# Altium project PCB_Project.PrjPcb
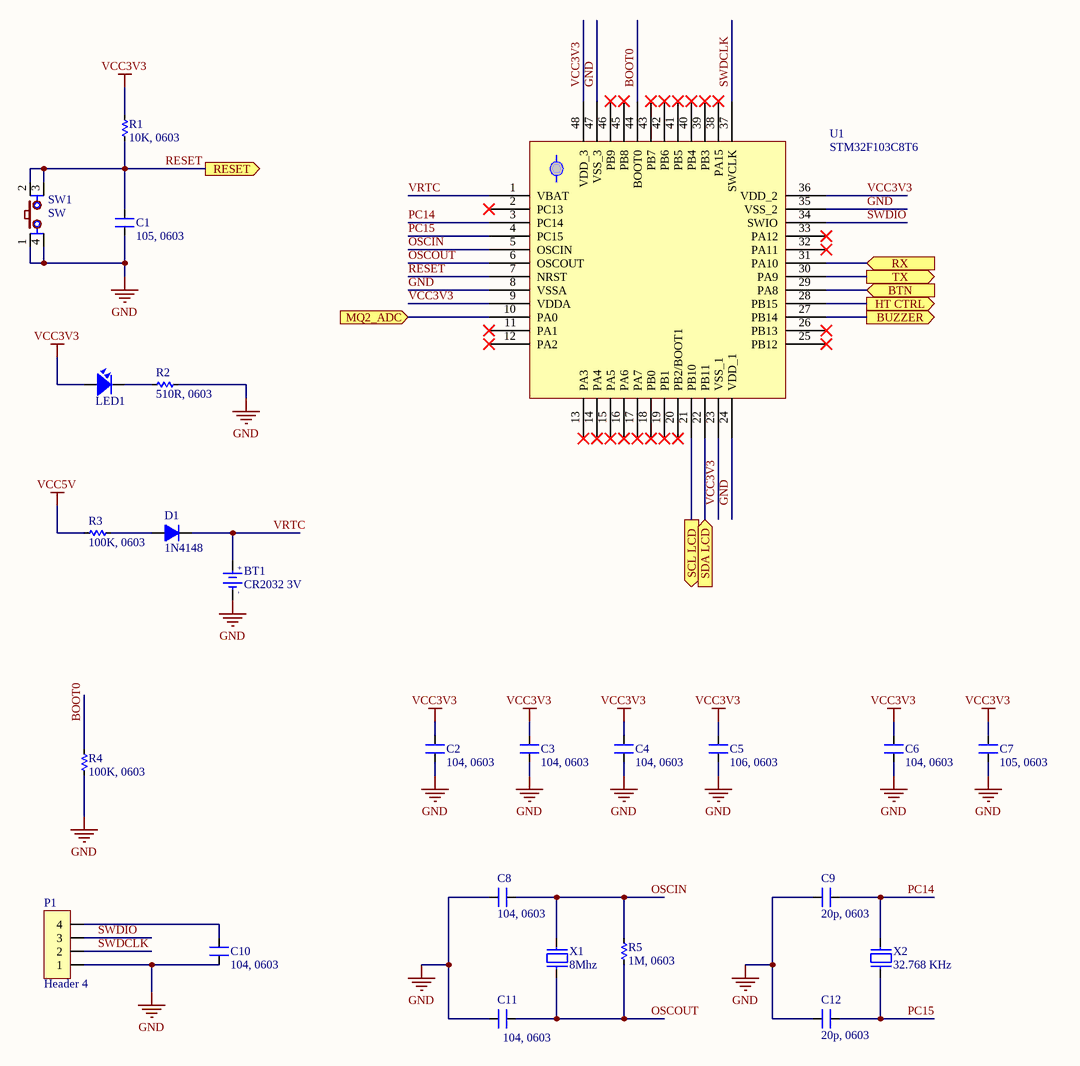
[diagram p0: MCU.SchDoc]
7 sheets, 69 parts. Net scope: flat (ports and power ports of the same name join across sheets).
Sheets:
  Sheet1.SchDoc
  MCU.SchDoc
  DISPLAY.SchDoc
  SENSOR.SchDoc
  COMM.SchDoc
  POWER.SchDoc
  Sheet2.SchDoc

## Sheet Sheet1.SchDoc
size A; SheetNumber: 1; SheetTotal: 7

## Sheet MCU.SchDoc
size B; SheetNumber: 2; SheetTotal: 7

### Parts
BT1  CR2032 3V  [PIN3V]
C1  105, 0603  [SM-0603]
C2  104, 0603  [SM-0603]
C3  104, 0603  [SM-0603]
C4  104, 0603  [SM-0603]
C5  106, 0603  [SM-0603]
C6  104, 0603  [SM-0603]
C7  105, 0603  [SM-0603]
C8  104, 0603  [SM-0603]
C9  20p, 0603  [SM-0603]
C10  104, 0603  [SM-0603]
C11  104, 0603  [SM-0603]
C12  20p, 0603  [SM-0603]
D1  1N4148  [D0.5A]
LED1  LED  [LED-0805-Blue]  (value not drawn)
P1  Header 4  [HDR/Header/4]
R1  10K, 0603  [RES-SMD-0603]
R2  510R, 0603  [RES-SMD-0603]
R3  100K, 0603  [RES-SMD-0603]
R4  100K, 0603  [RES-SMD-0603]
R5  1M, 0603  [RES-SMD-0603]
SW1  SW  [SW2-SMD]
U1  STM32F103C8T6  [QFP50P900X900X160-48N]
X1  8Mhz  [XT2]
X2  32.768 KHz  [XT2-SMD]

### Ports
BTN (in), BUZZER (out), HT CTRL (out), MQ2_ADC (in), RESET (out), RX (in), SCL LCD (out), SDA LCD (in), TX (out)

### Nets
GND: BT1.2(GND) C1.1 C2.1 C3.1 C4.1 C5.1 C6.1 C7.1 C8.1 C9.2 C10.1 C11.2 C12.2 P1.1 R2.2 R4.2 SW1.1 SW1.4 U1.8(VSSA) U1.24(VDD_1) U1.35(VSS_2) U1.47(VSS_3)
VCC3V3: C2.2 C3.2 C4.2 C5.2 C6.2 C7.2 LED1.1 R1.2 U1.9(VDDA) U1.23(VSS_1) U1.36(VDD_2) U1.48(VDD_3)
VCC5V: R3.1
BOOT0: R4.1 U1.44(BOOT0)
OSCIN: C8.2 R5.1 U1.5(OSCIN) X1.2
OSCOUT: C11.1 R5.2 U1.6(OSCOUT) X1.1
PC14: C9.1 U1.3(PC14) X2.2
PC15: C12.1 U1.4(PC15) X2.1
RESET: C1.2 R1.1 SW1.2 SW1.3 U1.7(NRST) ; port RESET
SWDCLK: P1.2 U1.37(SWCLK)
SWDIO: P1.3 U1.34(SWIO)
VRTC: BT1.1(+3V) D1.2(K) U1.1(VBAT)
NetC10_2: C10.2 P1.4
NetC13_2: U1.29(PA8) ; port BTN
NetD1_1: D1.1(A) R3.2
NetLED1_2: LED1.2 R2.1
NetR7_2: U1.27(PB14) ; port BUZZER
NetR11_2: U1.28(PB15) ; port HT CTRL
NetU1_10: U1.10(PA0) ; port MQ2_ADC
NetU1_21: U1.21(PB10) ; port SCL LCD
NetU1_22: U1.22(PB11) ; port SDA LCD
NetU1_30: U1.30(PA9) ; port TX
NetU1_31: U1.31(PA10) ; port RX

Not connected (* = marked no-connect by the designer): U1 2(PC13)* 11(PA1)* 12(PA2)* 13(PA3)* 14(PA4)* 15(PA5)* 16(PA6)* 17(PA7)* 18(PB0)* 19(PB1)* 20(PB2/BOOT1)* 25(PB12)* 26(PB13)* 32(PA11)* 33(PA12)* 38(PA15)* 39(PB3)* 40(PB4)* 41(PB5)* 42(PB6)* 43(PB7)* 45(PB8)* 46(PB9)*

### Notes on the sheet
- (in symbol PIN 3V) +; -

### Library data of the parts
BT1 = PIN 3V: CR2032 3VDC rechargeable; Value: PIN 3V
C1-C12 = CM: Cap SMD; Value: 103
D1 = D0.5A: Value: 1N4148
LED1 = LED SMD: Value: LED 3 - 5 ly 2 Colour
P1 = Header 4: Header, 4-Pin
R1-R5 = Res-SMD: Resistor; Manufacturer: Generic Components; Class: Passive; Published: 08/06/2000; Publisher: Altium Hobart Technology Centre
SW1 = SW4: Switch button 4 pin; Value: Button chip 4 pin
X1 = XT2: Crystal For all Crystal 2pin.; Value: 4Mhz
X2 = XT2: Crystal, 32.768 KHz, -40 to 85 degC, 3.2 x 1.5 x 0.9 mm SMD; Value: 4Mhz

## Sheet DISPLAY.SchDoc
size A; SheetNumber: 3; SheetTotal: 7
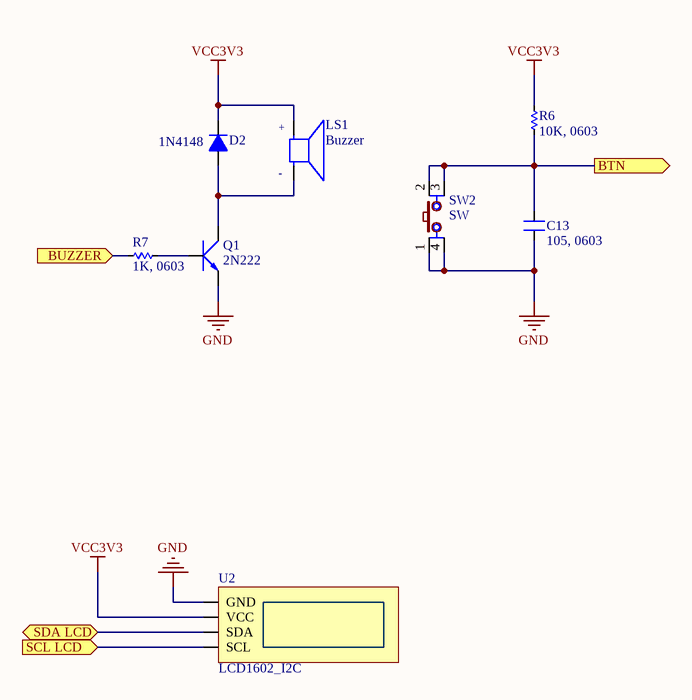
[diagram p1: DISPLAY.SchDoc]

### Parts
C13  105, 0603  [SM-0603]
D2  1N4148  [D0.5A]
LS1  Buzzer  [XDCR_AI-1027-TWT-3V-R]
Q1  2N222  [TO92-123]
R6  10K, 0603  [RES-SMD-0603]
R7  1K, 0603  [RES-SMD-0603]
SW2  SW  [SW2-SMD]
U2  LCD1602_I2C

### Ports
BTN (out), BUZZER (in), SCL LCD (in), SDA LCD (bidir)

### Nets
GND: C13.1 Q1.1(E) SW2.1 SW2.4 U2.1(GND)
VCC3V3: D2.2(K) LS1.P R6.2 U2.2(VCC)
NetC13_2: C13.2 R6.1 SW2.2 SW2.3 ; port BTN
NetD2_1: D2.1(A) LS1.N Q1.3(C)
NetQ1_2: Q1.2(B) R7.1
NetR7_2: R7.2 ; port BUZZER
NetU1_21: U2.4(SCL) ; port SCL LCD
NetU1_22: U2.3(SDA) ; port SDA LCD

### Notes on the sheet
- (in symbol AI-1027-TWT-3V-R) +; -

### Library data of the parts
C13 = CM: Cap SMD; Value: 103
D2 = D0.5A: Value: 1N4148
LS1 = AI-1027-TWT-3V-R: MF: {'manufacturer': u'PUI Audio,'}; Package: None; Price: None; Value: *; MP: AI-1027-TWT-3V-R; Availability: Unavailable
Q1 = 2N222: NPN 600mW, ECB; Value: C1815
R6 R7 = Res-SMD: as R1 on sheet MCU; Published: 08/06/2000; Publisher: Altium Hobart Technology Centre
SW2 = SW4: as SW1 on sheet MCU
U2 = LCD1602_I2C: Module LCD1602 I2C

## Sheet SENSOR.SchDoc
size A; SheetNumber: 4; SheetTotal: 7
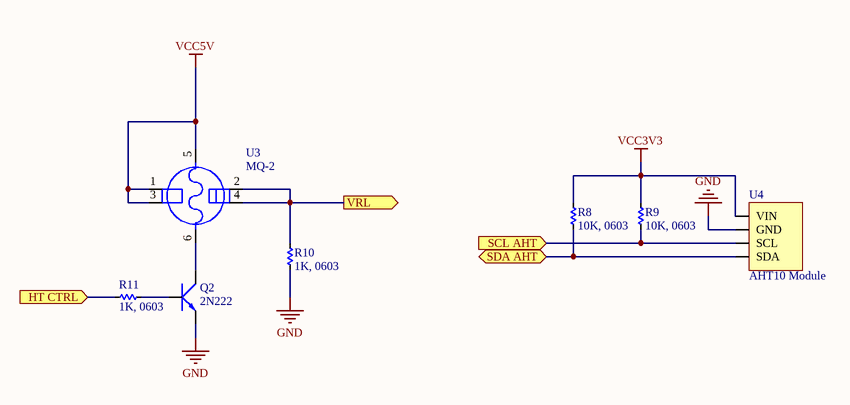
[diagram p2: SENSOR.SchDoc]

### Parts
Q2  2N222  [TO92-123]
R8  10K, 0603  [RES-SMD-0603]
R9  10K, 0603  [RES-SMD-0603]
R10  1K, 0603  [RES-SMD-0603]
R11  1K, 0603  [RES-SMD-0603]
U3  MQ-2  [SNR6-D19.0MM]
U4  AHT10 Module

### Ports
HT CTRL (in), SCL AHT (in), SDA AHT (bidir), VRL (out)

### Nets
GND: Q2.1(E) R10.2 U4.5(GND)
VCC3V3: R8.2 R9.2 U4.4(VIN)
VCC5V: U3.1(A0) U3.3(A1) U3.5(H@1)
NetQ2_2: Q2.2(B) R11.1
NetQ2_3: Q2.3(C) U3.6(H@2)
NetR8_1: R8.1 U4.7(SDA) ; port SDA AHT
NetR9_1: R9.1 U4.?1(SCL) ; port SCL AHT
NetR10_1: R10.1 U3.2(B0) U3.4(B1) ; port VRL
NetR11_2: R11.2 ; port HT CTRL

### Library data of the parts
Q2 = 2N222: NPN 600mW, ECB; Value: C1815
R8-R11 = Res-SMD: as R1 on sheet MCU; Published: 08/06/2000; Publisher: Altium Hobart Technology Centre
U3 = DIP-GAS-MQ-2(6P-D19MM): 314100003; MF: {'manufacturer': u'AirBorn'}; Package: None; Price: None; Value: *; MP: MQ-2; Availability: Unavailable
U4 = AHT10

## Sheet COMM.SchDoc
size A; SheetNumber: 5; SheetTotal: 7
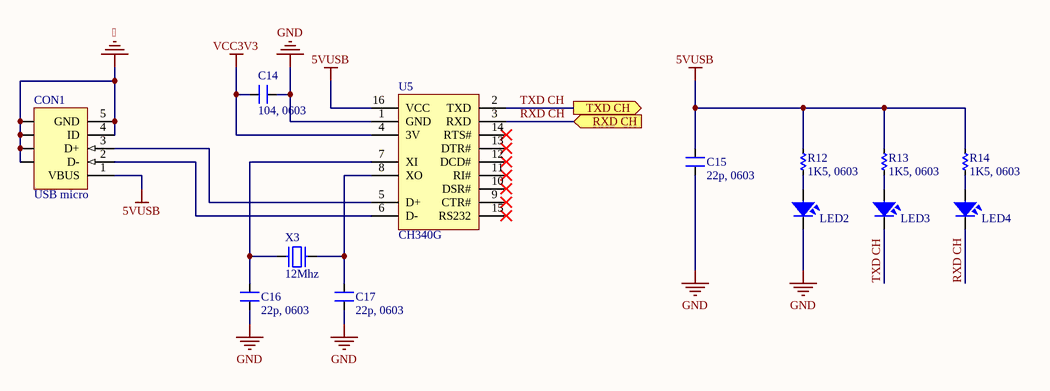
[diagram p3: COMM.SchDoc]

### Parts
C14  104, 0603  [SM-0603]
C15  22p, 0603  [SM-0603]
C16  22p, 0603  [SM-0603]
C17  22p, 0603  [SM-0603]
CON1  USB micro  [CONN/USB/MICRO/RA]
LED2  LED  [LED-0805-Blue]  (value not drawn)
LED3  LED  [LED-0805-Blue]  (value not drawn)
LED4  LED  [LED-0805-Blue]  (value not drawn)
R12  1K5, 0603  [RES-SMD-0603]
R13  1K5, 0603  [RES-SMD-0603]
R14  1K5, 0603  [RES-SMD-0603]
U5  CH340G  [SO16]
X3  12Mhz  [XT2]

### Ports
RXD CH (in), TXD CH (out)

### Nets
5VUSB: C15.2 CON1.1(VBUS) R12.1 R13.1 R14.1 U5.16(VCC)
: CON1.4(ID) CON1.5(GND) CON1.6(SHLD) CON1.7(SHLD) CON1.8(SHLD) CON1.9(SHLD)
GND: C14.1 C15.1 C16.1 C17.1 LED2.2 U5.1(GND)
VCC3V3: C14.2 U5.4(3V)
RXD CH: LED4.2 U5.3(RXD) ; port RXD CH
TXD CH: LED3.2 U5.2(TXD) ; port TXD CH
NetC16_2: C16.2 U5.7(XI) X3.1
NetC17_2: C17.2 U5.8(XO) X3.2
NetCON1_2: CON1.2(D-) U5.6(D-)
NetCON1_3: CON1.3(D+) U5.5(D+)
NetLED2_1: LED2.1 R12.2
NetLED3_1: LED3.1 R13.2
NetLED4_1: LED4.1 R14.2

Not connected (* = marked no-connect by the designer): U5 9(CTR#)* 10(DSR#)* 11(RI#)* 12(DCD#)* 13(DTR#)* 14(RTS#)* 15(RS232)*

### Library data of the parts
C14-C17 = CM: Cap SMD; Value: 103
CON1 = CON USB micro: USB micro, 5 pins
LED2-LED4 = LED SMD: Value: LED 3 - 5 ly 2 Colour
R12-R14 = Res-SMD: as R1 on sheet MCU; Published: 08/06/2000; Publisher: Altium Hobart Technology Centre
U5 = CH340G: High and Low Side Driver; Note: Pins 4, 8 and 14 are not connected; Published: 8-Jun-2000; LatestRevisionDate: 04-Mar-2005; LatestRevisionNote: Stylized 3D Model Added.; DatasheetVersion: PD60147J; PackageReference: PDIP14; Publisher: Altium Limited; PackageDescription: DIP; 14 Leads; Row Spacing 7.62 mm; Pitch 2.54 mm; ComponentLink1Description: Manufacturer Link; ComponentLink1URL: http://www.irf.com/; ComponentLink2Description: Datasheet; ComponentLink2URL: http://www.irf.com/product-info/datasheets/data/ir2110.pdf
X3 = XT2: as X2 on sheet MCU

## Sheet POWER.SchDoc
size A; SheetNumber: 6; SheetTotal: 7
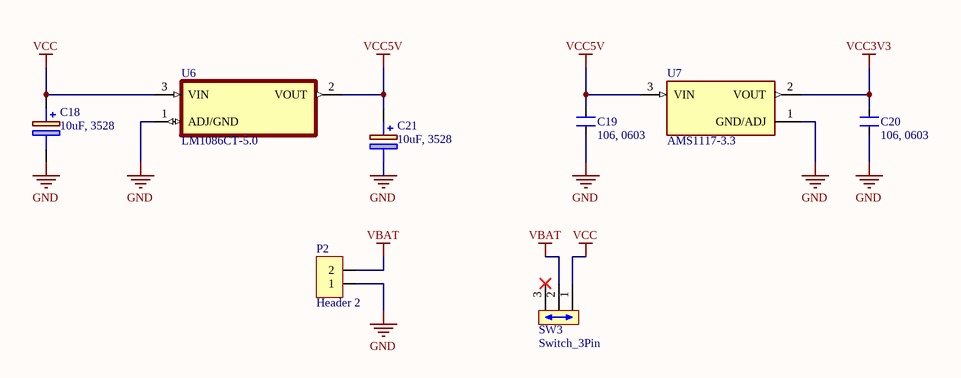
[diagram p4: POWER.SchDoc]

### Parts
C18  10uF, 3528  [CAP-TANTAL-3528]
C19  106, 0603  [SM-0603]
C20  106, 0603  [SM-0603]
C21  10uF, 3528  [CAP-TANTAL-3528]
P2  Header 2  [HDR/Header/2]
SW3  Switch_3Pin  [SW-12F23]
U6  LM1086CT-5.0  [TO254P1054X470X1955-3]
U7  AMS1117-3.3  [SOT229P700X180-4N]

### Nets
GND: C18.2 C19.1 C20.1 C21.2 P2.1 U6.1(ADJ/GND) U7.1(GND/ADJ)
VBAT: P2.2 SW3.2(COMMON)
VCC: C18.1 SW3.1 U6.3(VIN)
VCC3V3: C20.2 U7.2(VOUT)
VCC5V: C19.2 C21.1 U6.2(VOUT) U7.3(VIN)

Not connected (* = marked no-connect by the designer): SW3 3*

### Library data of the parts
C18 C21 = CAP Tantalum: Tantalum Capacitor
C19 C20 = CM: Cap SMD; Value: 103
P2 = Header 2: Header, 2-Pin
SW3 = Switch_3Pin: Switch; Published: 24-Mar-1999; LatestRevisionDate: 17-Jul-2002; LatestRevisionNote: Re-released for DXP Platform.; PackageReference: SPST-2; Publisher: Altium Limited
U6 = LM1086CT-5.0: MF: {'manufacturer': u'Texas Instruments'}; MP: LM1086CT-5.0/NOPB; Package: None; Price: None; Value: *; Availability: Unavailable
U7 = AMS1117-3.3: MF: {'manufacturer': u'Advanced Monolithic Systems'}; Package: None; Price: None; Value: *; MP: AMS1117-3.3; Availability: Unavailable

## Sheet Sheet2.SchDoc
size A; SheetNumber: 7; SheetTotal: 7
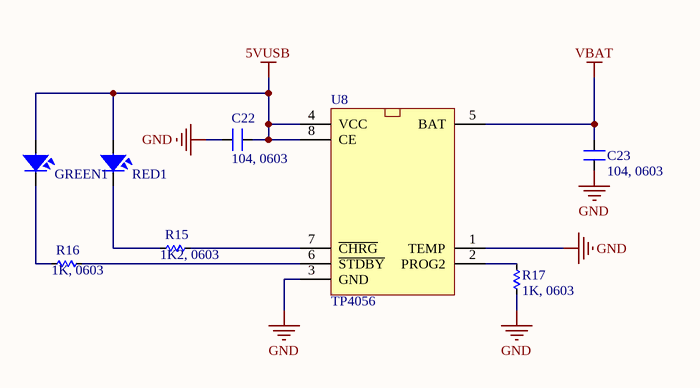
[diagram p5: Sheet2.SchDoc]

### Parts
C22  104, 0603  [SM-0603]
C23  104, 0603  [SM-0603]
GREEN1  LED  [LED-0805-Blue]  (value not drawn)
R15  1K2, 0603  [RES-SMD-0603]
R16  1K, 0603  [RES-SMD-0603]
R17  1K, 0603  [RES-SMD-0603]
RED1  LED  [LED-0805-Blue]  (value not drawn)
U8  TP4056  [SOP8_L]

### Nets
5VUSB: C22.1 GREEN1.1 RED1.1 U8.4(VCC) U8.8(CE)
GND: C22.2 C23.2 R17.2 U8.1(TEMP) U8.3(GND)
VBAT: C23.1 U8.5(BAT)
NetGREEN1_2: GREEN1.2 R16.2
NetR15_1: R15.1 U8.7(~{CHRG})
NetR15_2: R15.2 RED1.2
NetR16_1: R16.1 U8.6(~{STDBY})
NetR17_1: R17.1 U8.2(PROG2)

### Library data of the parts
C22 C23 = CM: Cap SMD; Value: 103
GREEN1 RED1 = LED SMD: Value: LED 3 - 5 ly 2 Colour
R15-R17 = Res-SMD: as R1 on sheet MCU; Published: 08/06/2000; Publisher: Altium Hobart Technology Centre
U8 = TP4056: 1A Standalone Linear Li-lon Battery Charger with Thermal   Regulation

## Nets that join several sheets
5VUSB: COMM (6 pins), Sheet2 (5 pins)
GND: MCU (22 pins), DISPLAY (5 pins), SENSOR (Q2.1 R10.2 U4.5), COMM (6 pins), POWER (7 pins), Sheet2 (5 pins)
VBAT: POWER (P2.2 SW3.2), Sheet2 (C23.1 U8.5)
VCC3V3: MCU (12 pins), DISPLAY (D2.2 LS1.P R6.2 U2.2), SENSOR (R8.2 R9.2 U4.4), COMM (C14.2 U5.4), POWER (C20.2 U7.2)
VCC5V: MCU (R3.1), SENSOR (U3.1 U3.3 U3.5), POWER (C19.2 C21.1 U6.2 U7.3)
NetC13_2: MCU (U1.29), DISPLAY (C13.2 R6.1 SW2.2 SW2.3)
NetR7_2: MCU (U1.27), DISPLAY (R7.2)
NetR11_2: MCU (U1.28), SENSOR (R11.2)
NetU1_21: MCU (U1.21), DISPLAY (U2.4)
NetU1_22: MCU (U1.22), DISPLAY (U2.3)